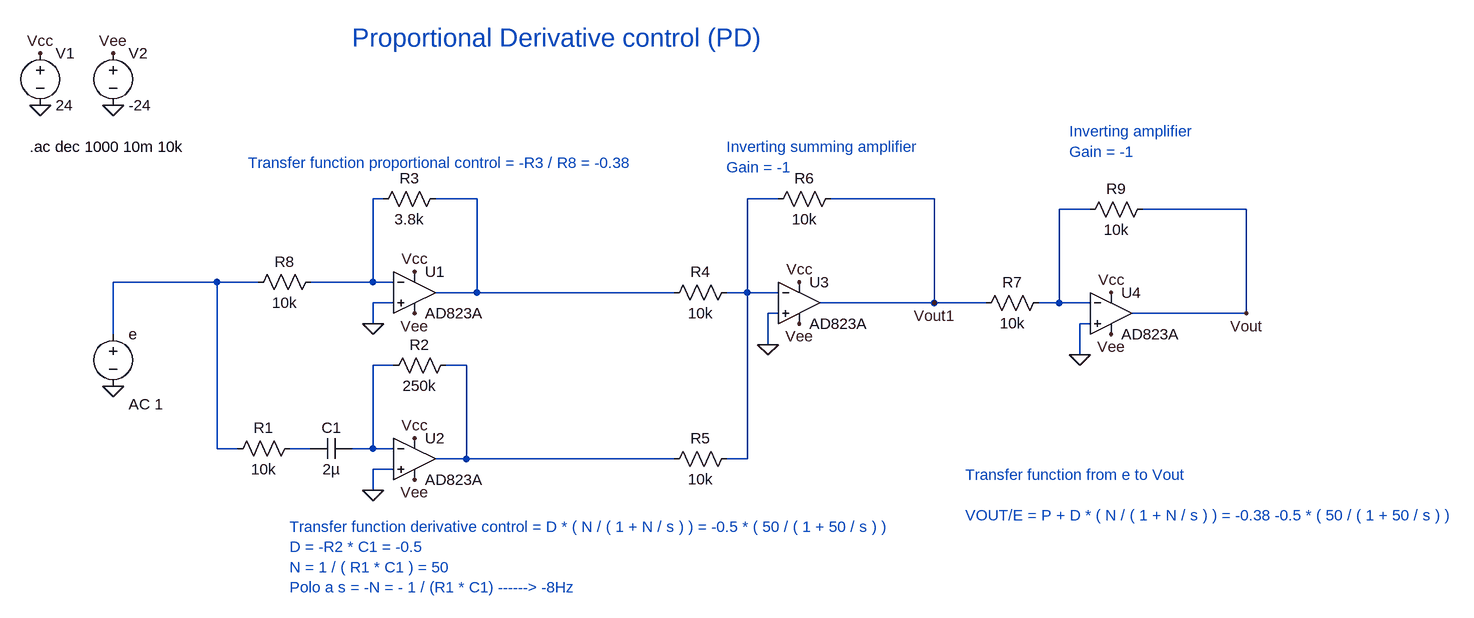
[diagram p0: schematic PD-controller.asc]
PD-controller.asc, the LTspice schematic file:
Version 4
SHEET 1 1788 680
WIRE 160 -48 144 -48
WIRE 304 -48 240 -48
WIRE 768 -48 720 -48
WIRE 1008 -48 848 -48
WIRE 1248 -32 1200 -32
WIRE 1488 -32 1328 -32
WIRE -96 80 -256 80
WIRE -32 80 -96 80
WIRE 144 80 144 -48
WIRE 144 80 48 80
WIRE 176 80 144 80
WIRE 304 96 304 -48
WIRE 304 96 240 96
WIRE 608 96 304 96
WIRE 720 96 720 -48
WIRE 720 96 688 96
WIRE 768 96 720 96
WIRE 176 112 144 112
WIRE 1008 112 1008 -48
WIRE 1008 112 832 112
WIRE 1088 112 1008 112
WIRE 1200 112 1200 -32
WIRE 1200 112 1168 112
WIRE 1248 112 1200 112
WIRE 768 128 752 128
WIRE 1488 128 1488 -32
WIRE 1488 128 1312 128
WIRE 144 144 144 112
WIRE 1248 144 1232 144
WIRE -256 160 -256 80
WIRE 752 176 752 128
WIRE 1232 192 1232 144
WIRE 176 208 144 208
WIRE 288 208 256 208
WIRE -96 336 -96 80
WIRE -64 336 -96 336
WIRE 48 336 16 336
WIRE 144 336 144 208
WIRE 144 336 112 336
WIRE 176 336 144 336
WIRE 288 352 288 208
WIRE 288 352 240 352
WIRE 608 352 288 352
WIRE 720 352 720 96
WIRE 720 352 688 352
WIRE 176 368 144 368
WIRE 144 400 144 368
FLAG 144 400 0
FLAG 144 144 0
FLAG 752 176 0
FLAG -256 240 0
FLAG -368 -192 0
FLAG -256 -192 0
FLAG -368 -272 Vcc
FLAG 208 64 Vcc
FLAG 800 80 Vcc
FLAG 208 320 Vcc
FLAG -256 -272 Vee
FLAG 208 128 Vee
FLAG 800 144 Vee
FLAG 208 384 Vee
FLAG 1008 112 Vout1
FLAG 1232 192 0
FLAG 1280 96 Vcc
FLAG 1280 160 Vee
FLAG 1488 128 Vout
SYMBOL Opamps\\AD823A 208 32 R0
SYMATTR InstName U1
SYMBOL Opamps\\AD823A 208 288 R0
SYMATTR InstName U2
SYMBOL res -48 96 R270
WINDOW 0 32 56 VTop 2
WINDOW 3 0 56 VBottom 2
SYMATTR InstName R8
SYMATTR Value 10k
SYMBOL res 160 224 R270
WINDOW 0 32 56 VTop 2
WINDOW 3 0 56 VBottom 2
SYMATTR InstName R2
SYMATTR Value 250k
SYMBOL res 144 -32 R270
WINDOW 0 32 56 VTop 2
WINDOW 3 0 56 VBottom 2
SYMATTR InstName R3
SYMATTR Value 3.8k
SYMBOL res 592 112 R270
WINDOW 0 32 56 VTop 2
WINDOW 3 0 56 VBottom 2
SYMATTR InstName R4
SYMATTR Value 10k
SYMBOL res 592 368 R270
WINDOW 0 32 56 VTop 2
WINDOW 3 0 56 VBottom 2
SYMATTR InstName R5
SYMATTR Value 10k
SYMBOL res 752 -32 R270
WINDOW 0 32 56 VTop 2
WINDOW 3 0 56 VBottom 2
SYMATTR InstName R6
SYMATTR Value 10k
SYMBOL Opamps\\AD823A 800 48 R0
SYMATTR InstName U3
SYMBOL cap 112 320 R90
WINDOW 0 0 32 VBottom 2
WINDOW 3 32 32 VTop 2
SYMATTR InstName C1
SYMATTR Value 2µ
SYMBOL voltage -368 -288 R0
WINDOW 123 0 0 Left 2
WINDOW 39 0 0 Left 2
SYMATTR InstName V1
SYMATTR Value 24
SYMBOL voltage -256 -288 R0
WINDOW 123 0 0 Left 2
WINDOW 39 0 0 Left 2
SYMATTR InstName V2
SYMATTR Value -24
SYMBOL voltage -256 144 R0
WINDOW 123 24 124 Left 2
WINDOW 39 0 0 Left 2
SYMATTR Value2 AC 1
SYMATTR InstName e
SYMATTR Value ""
SYMBOL res -80 352 R270
WINDOW 0 32 56 VTop 2
WINDOW 3 0 56 VBottom 2
SYMATTR InstName R1
SYMATTR Value 10k
SYMBOL res 1072 128 R270
WINDOW 0 32 56 VTop 2
WINDOW 3 0 56 VBottom 2
SYMATTR InstName R7
SYMATTR Value 10k
SYMBOL res 1232 -16 R270
WINDOW 0 32 56 VTop 2
WINDOW 3 0 56 VBottom 2
SYMATTR InstName R9
SYMATTR Value 10k
SYMBOL Opamps\\AD823A 1280 64 R0
SYMATTR InstName U4
TEXT -384 -128 Left 2 !.ac dec 1000 10m 10k
TEXT -48 -104 Left 2 ;Transfer function proportional control = -R3 / R8 = -0.38
TEXT 16 456 Left 2 ;Transfer function derivative control = D * ( N / ( 1 + N / s ) ) = -0.5 * ( 50 / ( 1 + 50 / s ) )\nD = -R2 * C1 = -0.5\nN = 1 / ( R1 * C1 ) = 50\nPolo a s = -N = - 1 / (R1 * C1) ------> -8Hz
TEXT 112 -296 Left 4 ;Proportional Derivative control (PD)
TEXT 688 -128 Left 2 ;Inverting summing amplifier\nGain = -1
TEXT 1216 -152 Left 2 ;Inverting amplifier\nGain = -1
TEXT 1056 376 Left 2 ;Transfer function from e to Vout\n \nVOUT/E = P + D * ( N / ( 1 + N / s ) ) = -0.38 -0.5 * ( 50 / ( 1 + 50 / s ) )

The netlist it stands for:
* PD-controller.asc
XU1 0 N001 Vcc Vee N002 AD823A  ; pins In+ In- V+ V- OUT
XU2 0 N006 Vcc Vee N007 AD823A  ; pins In+ In- V+ V- OUT
R8 N005 N001 10k
R2 N006 N007 250k
R3 N001 N002 3.8k
R4 N002 N003 10k
R5 N007 N003 10k
R6 N003 Vout1 10k
XU3 0 N003 Vcc Vee Vout1 AD823A  ; pins In+ In- V+ V- OUT
C1 N006 N008 2µ
V1 Vcc 0 24
V2 Vee 0 -24
V§e N005 0 AC 1
R1 N005 N008 10k
R7 Vout1 N004 10k
R9 N004 Vout 10k
XU4 0 N004 Vcc Vee Vout AD823A  ; pins In+ In- V+ V- OUT
.ac dec 1000 10m 10k
* Transfer function proportional control = -R3 / R8 = -0.38
* Transfer function derivative control = D * ( N / ( 1 + N / s ) ) = -0.5 * ( 50 / ( 1 + 50 / s ) )
* D = -R2 * C1 = -0.5
* N = 1 / ( R1 * C1 ) = 50
* Polo a s = -N = - 1 / (R1 * C1) ------> -8Hz
* Proportional Derivative control (PD)
* Inverting summing amplifier
* Gain = -1
* Inverting amplifier
* Gain = -1
* Transfer function from e to Vout
* VOUT/E = P + D * ( N / ( 1 + N / s ) ) = -0.38 -0.5 * ( 50 / ( 1 + 50 / s ) )
.backanno
.end